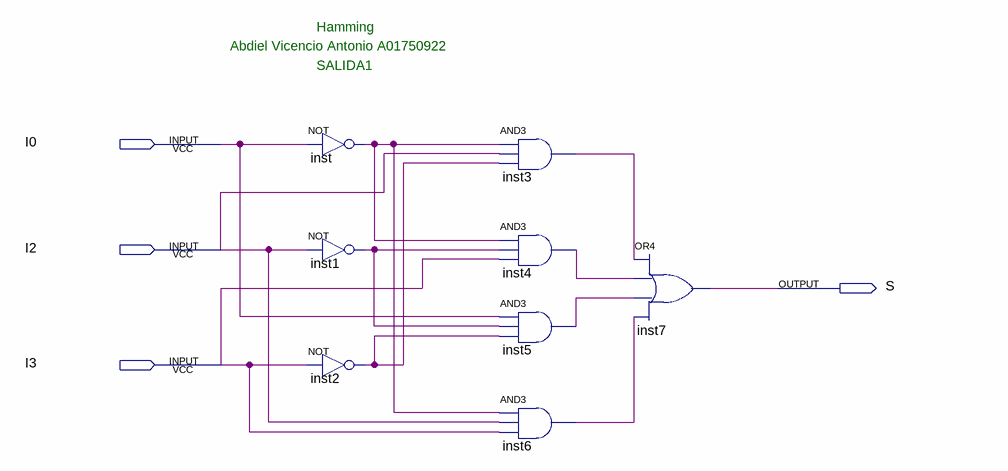
[diagram p0: schematic sheet]
// Quartus schematic HammingS1.bdf as structural Verilog: 8 symbols, 4 pins
module HammingS1 (
  input  I0,
  input  I2,
  input  I3,
  output S
);

  wire inst1_out, inst2_out, inst3_out, inst4_out, inst5_out, inst6_out, inst_out;

  not inst (inst_out, I0);
  not inst1 (inst1_out, I2);
  not inst2 (inst2_out, I3);
  and inst3 (inst3_out, inst_out, I2, inst2_out);
  and inst4 (inst4_out, inst_out, inst1_out, I3);
  and inst5 (inst5_out, I0, inst1_out, inst2_out);
  and inst6 (inst6_out, inst_out, I2, I3);
  or inst7 (S, inst3_out, inst4_out, inst5_out, inst6_out);

  // Notes on the sheet:
  //   Hamming
  //   Abdiel Vicencio Antonio A01750922
  //   SALIDA1
endmodule
